# EAGLE design main (EAGLE 8.0.1)
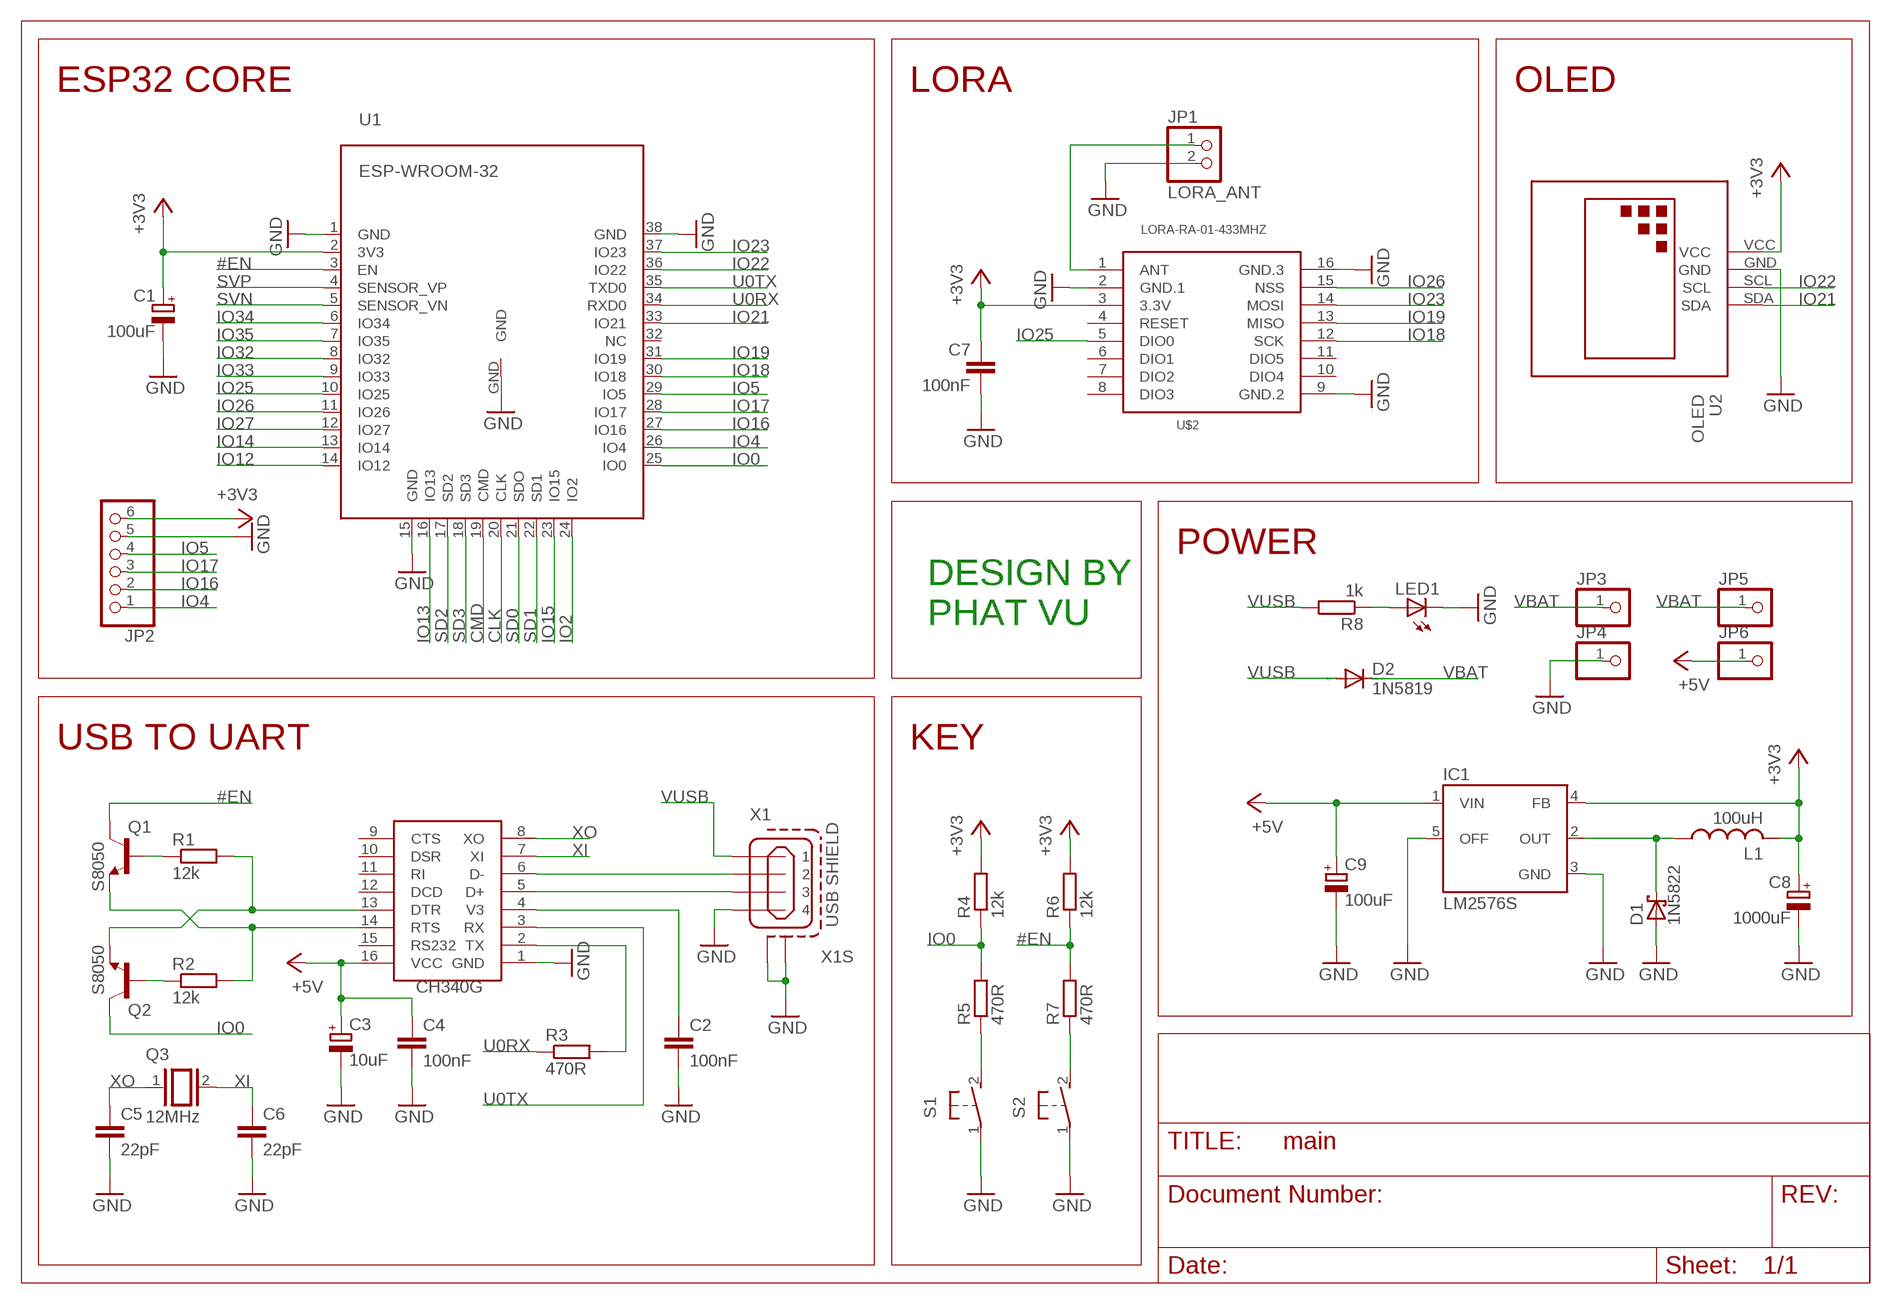
[diagram p0: schematic, sheet 1]

## Parts
C1  100uF  CPOL-EUE5-10.5  [E5-10,5]
C2  100nF  C-EU050-024X044  [C050-024X044]
C3  10uF  CPOL-EUE2.5-6  [E2,5-6]
C4  100nF  C-EU050-024X044  [C050-024X044]
C5  22pF  C-EU050-024X044  [C050-024X044]
C6  22pF  C-EU050-024X044  [C050-024X044]
C7  100nF  C-EU050-024X044  [C050-024X044]
C8  1000uF  CPOL-EUE5-13  [E5-13]
C9  100uF  CPOL-EUE5-10.5  [E5-10,5]
D1  1N5822  SCHOTTKY-DIODEDO201T15  [DO201T15]
D2  1N5819  1N4004  [DO41-10]
IC1  LM2576S  [TO263-5]
JP1  LORA_ANT  PINHD-1X2  [1X02]
JP2  PINHD-1X6  [1X06]
JP3  PINHD-1X1  [1X01]
JP4  PINHD-1X1  [1X01]
JP5  PINHD-1X1  [1X01]
JP6  PINHD-1X1  [1X01]
L1  100uH  L-US6000-XXX-RC  [6000-XXXX-RC]
LED1  LED3MM  [LED3MM]
Q1  S8050  S8050TO92  [TO92-EBC]
Q2  S8050  S8050TO92  [TO92-EBC]
Q3  12MHz  XTAL/S  [QS]
R1  12k  R-EU_0207/10  [0207/10]
R2  12k  R-EU_0207/10  [0207/10]
R3  470R  R-EU_0207/10  [0207/10]
R4  12k  R-EU_0207/10  [0207/10]
R5  470R  R-EU_0207/10  [0207/10]
R6  12k  R-EU_0207/10  [0207/10]
R7  470R  R-EU_0207/10  [0207/10]
R8  1k  R-EU_0207/10  [0207/10]
S1  31-XX  [B3F-31XX]
S2  31-XX  [B3F-31XX]
U1  ESP-WROOM-32  [ESP-WROOM-32]
U2  OLED  OLED-096-I2C  [OLED-096-I2C]
U$1  CH340G  [SOIC16]
U$2  LORA-RA-01-433MHZ  [LORA-RA1-SMD]
X1  USB SHIELD  MINI-USB_SHIELD4P-85-32004-00X  [85-32004-00X]

## Nets
#EN: Q1.C R6.1 R7.2 U1.3(EN)
+3V3: C1.+ C7.1 C8.+ IC1.4(FB) JP2.6 L1.2 R4.2 R6.2 U1.2(3V3) U2.VCC U$2.3(3.3V)
+5V: C3.+ C4.1 C9.+ IC1.1(VIN) JP6.1 U$1.16(VCC)
CLK: U1.20(CLK)
CMD: U1.19(CMD)
GND: C1.- C2.2 C3.- C4.2 C5.2 C6.2 C7.2 C8.- C9.- D1.A IC1.3(GND) IC1.5(OFF) JP1.2 JP2.5 JP4.1 LED1.K(C) S1.1(P) S2.1(P) U1.1(GND) U1.15(GND) U1.38(GND) U1.GND U2.GND U$1.1(GND) U$2.2(GND.1) U$2.9(GND.2) U$2.16(GND.3) X1.4 X1.M1(S1) X1.M2(S2)
IO0: Q2.C R4.1 R5.2 U1.25(IO0)
IO2: U1.24(IO2)
IO4: JP2.1 U1.26(IO4)
IO5: JP2.4 U1.29(IO5)
IO12: U1.14(IO12)
IO13: U1.16(IO13)
IO14: U1.13(IO14)
IO15: U1.23(IO15)
IO16: JP2.2 U1.27(IO16)
IO17: JP2.3 U1.28(IO17)
IO18: U1.30(IO18) U$2.12(SCK)
IO19: U1.31(IO19) U$2.13(MISO)
IO21: U1.33(IO21) U2.SDA
IO22: U1.36(IO22) U2.SCL
IO23: U1.37(IO23) U$2.14(MOSI)
IO25: U1.10(IO25) U$2.5(DIO0)
IO26: U1.11(IO26) U$2.15(NSS)
IO27: U1.12(IO27)
IO32: U1.8(IO32)
IO33: U1.9(IO33)
IO34: U1.6(IO34)
IO35: U1.7(IO35)
N$1: JP1.1 U$2.1(ANT)
N$2: R3.2 U$1.2(TX)
N$3: U$1.6(D-) X1.2
N$4: U$1.5(D+) X1.3
N$5: C2.1 U$1.4(V3)
N$6: Q1.E R2.2 U$1.14(RTS)
N$7: Q2.E R1.2 U$1.13(DTR)
N$8: LED1.A R8.1
N$9: Q2.B R2.1
N$10: Q1.B R1.1
N$11: R7.1 S2.2(S)
N$12: R5.1 S1.2(S)
N$13: D1.C IC1.2(OUT) L1.1
SD0: U1.21(SDO)
SD1: U1.22(SD1)
SD2: U1.17(SD2)
SD3: U1.18(SD3)
SVN: U1.5(SENSOR_VN)
SVP: U1.4(SENSOR_VP)
U0RX: R3.1 U1.34(RXD0)
U0TX: U1.35(TXD0) U$1.3(RX)
VBAT: D2.C JP3.1 JP5.1
VUSB: D2.A R8.2 X1.1
XI: C6.1 Q3.2 U$1.7(XI)
XO: C5.1 Q3.1 U$1.8(XO)
Unconnected: U1.32(NC) U$1.9(CTS) U$1.10(DSR) U$1.11(RI) U$1.12(DCD) U$1.15(RS232) U$2.4(RESET) U$2.6(DIO1) U$2.7(DIO2) U$2.8(DIO3) U$2.10(DIO4) U$2.11(DIO5)

## Notes on the sheet
- ESP32 CORE | LORA | OLED
- POWER
- DESIGN BY
  PHAT VU
- USB TO UART | KEY

## Library data of the parts
C1 C3 C8 C9 = rcl:CPOL-EU: POLARIZED CAPACITOR, European symbol
C2 C4-C7 = rcl:C-EU: CAPACITOR, European symbol
D1 = diode:SCHOTTKY-DIODE: Schottky Diode
D2 = diode:1N4004: DIODE general purpose rectifier, 1 A
IC1 = lm2576:LM2576: National Semiconductor <http://www.national.com> 3.0A "Simple Switcher"(c) 52kHz, Vout 1.23-37V (HV: 57V), Vin 40V (HV: 60V), 50µA standby current
JP1 = pinhead:PINHD-1X2: PIN HEADER
JP2 = pinhead:PINHD-1X6: PIN HEADER
JP3-JP6 = pinhead:PINHD-1X1: PIN HEADER
L1 = rcl:L-US: INDUCTOR, American symbol
LED1 = led:LED: LED OSRAM: - CHIPLED LG R971, LG N971, LY N971, LG Q971, LY Q971, LO R971, LY R971 LH N974, LH R974 LS Q976, LO Q976, LY Q976 LO Q996 - Hyper CHIPLED LW Q18S LB Q993, LB Q99A, LB R99A - SideLED LS A670, LO A670, LY A670, LG A670, LP A670 LB A673, LV A673, LT A673, LW A673 LH A674 LY A675 LS A676, LA A676, LO A676, LY A676, LW A676 LS A679, LY A679, LG A679 - Hyper Micro SIDELED® LS Y876, LA Y876, LO Y876, LY Y876 LT Y87S - SmartLED LW L88C, LW L88S LB L89C, LB L89S, LG L890 LS L89K, LO L89K, LY L89K LS L896, LA L896, LO L896, LY L896 - TOPLED LS T670, LO T670, LY T670, LG T670, LP T670 LSG T670, LSP T670, LSY T670, LOP T670, LYG T670 LG T671, LOG T671, LSG T671 LB T673, LV T673, LT T673, LW T673 LH T674 LS T676, LA T676, LO T676, LY T676, LB T676, LH T676, LSB T676, LW T676 LB T67C, LV T67C, LT T67C, LS T67K, LO T67K, LY T67K, LW E67C LS E67B, LA E67B, LO E67B, LY E67B, LB E67C, LV E67C, LT E67C LW T67C LS T679, LY T679, LG T679 LS T770, LO T770, LY T770, LG T770, LP T770 LB T773, LV T773, LT T773, LW T773 LH T774 LS E675, LA E675, LY E675, LS T675 LS T776, LA T776, LO T776, LY T776, LB T776 LHGB T686 LT T68C, LB T68C - Hyper Mini TOPLED® LB M676 - Mini TOPLED Santana® LG M470 LS M47K, LO M47K, LY M47K Source: http://www.osram.convergy.de LUXEON: - LUMILED® LXK2-PW12-R00, LXK2-PW12-S00, LXK2-PW14-U00, LXK2-PW14-V00 LXK2-PM12-R00, LXK2-PM12-S00, LXK2-PM14-U00 LXK2-PE12-Q00, LXK2-PE12-R00, LXK2-PE12-S00, LXK2-PE14-T00, LXK2-PE14-U00 LXK2-PB12-K00, LXK2-PB12-L00, LXK2-PB12-M00, LXK2-PB14-N00, LXK2-PB14-P00, LXK2-PB14-Q00 LXK2-PR12-L00, LXK2-PR12-M00, LXK2-PR14-Q00, LXK2-PR14-R00 LXK2-PD12-Q00, LXK2-PD12-R00, LXK2-PD12-S00 LXK2-PH12-R00, LXK2-PH12-S00 LXK2-PL12-P00, LXK2-PL12-Q00, LXK2-PL12-R00 Source: www.luxeon.com KINGBRIGHT: KA-3528ASYC Source: www.kingbright.com
Q1 Q2 = s8050:S8050
Q3 = special:XTAL/S: CRYSTAL
R1-R8 = rcl:R-EU_: RESISTOR, European symbol
S1 S2 = switch-omron:31-XX: OMRON SWITCH; MPN: B3F-3100; OC_FARNELL: 959704; OC_NEWARK: 36M3582
U1 = esp32:ESP-WROOM-32
U2 = oled:OLED-096-I2C
U$1 = ch340g:CH340G
U$2 = lora:LORA-RA-01-433MHZ: 433 MHz Lora Ra-01 Radio Transceiver Module based on SX1278 chip.
X1 = con-cypressindustries:MINI-USB_SHIELD4P-: MINI USB 4 Pol. Source: www.cypressindustries.com; OC_FARNELL: unknown; OC_NEWARK: unknown

## Board
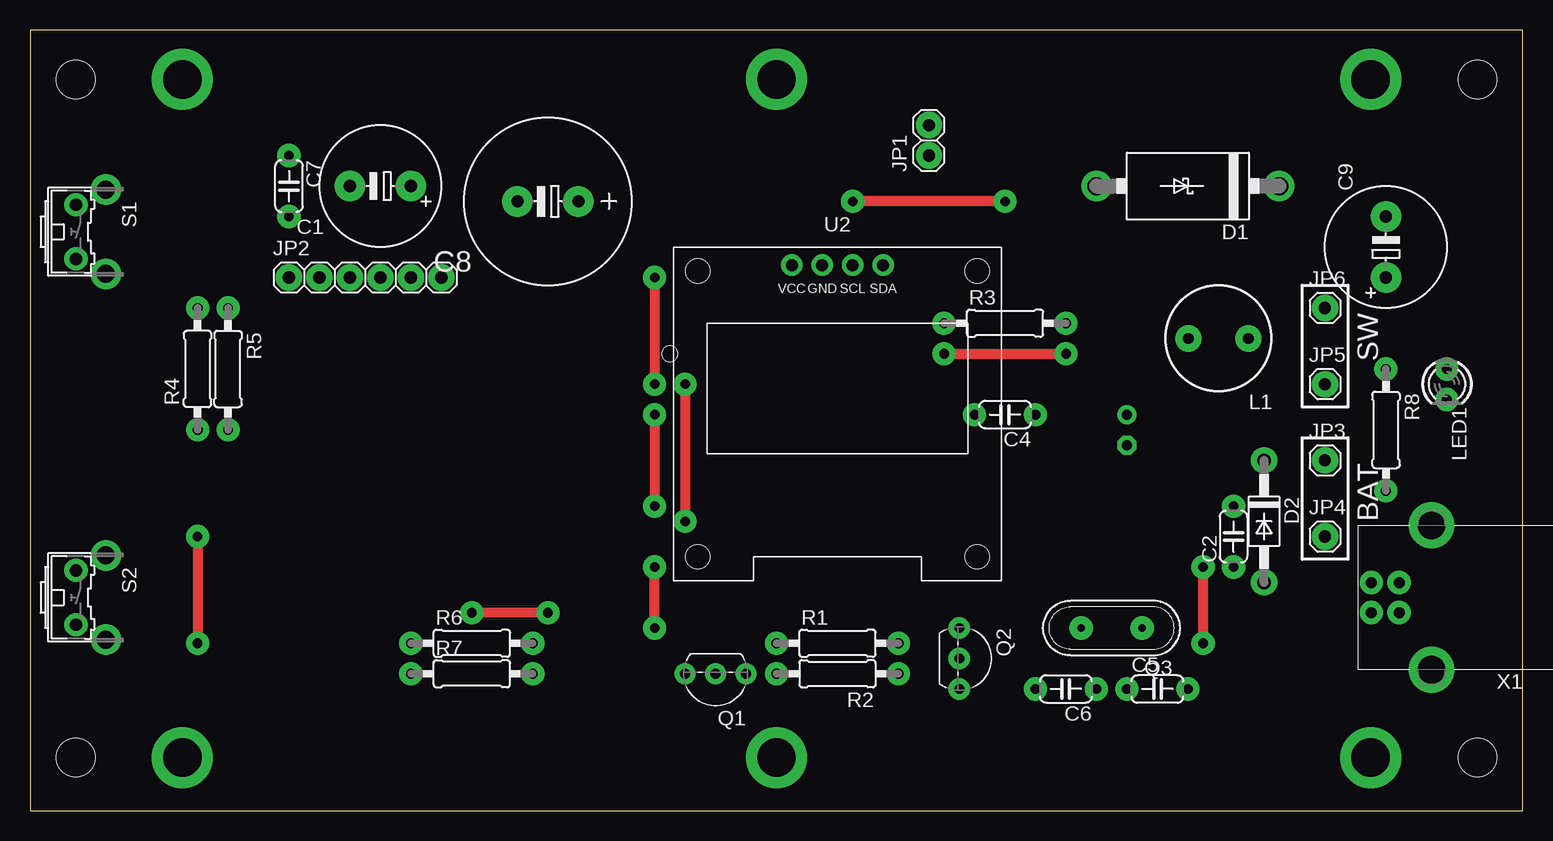
[diagram p1: board, top side]
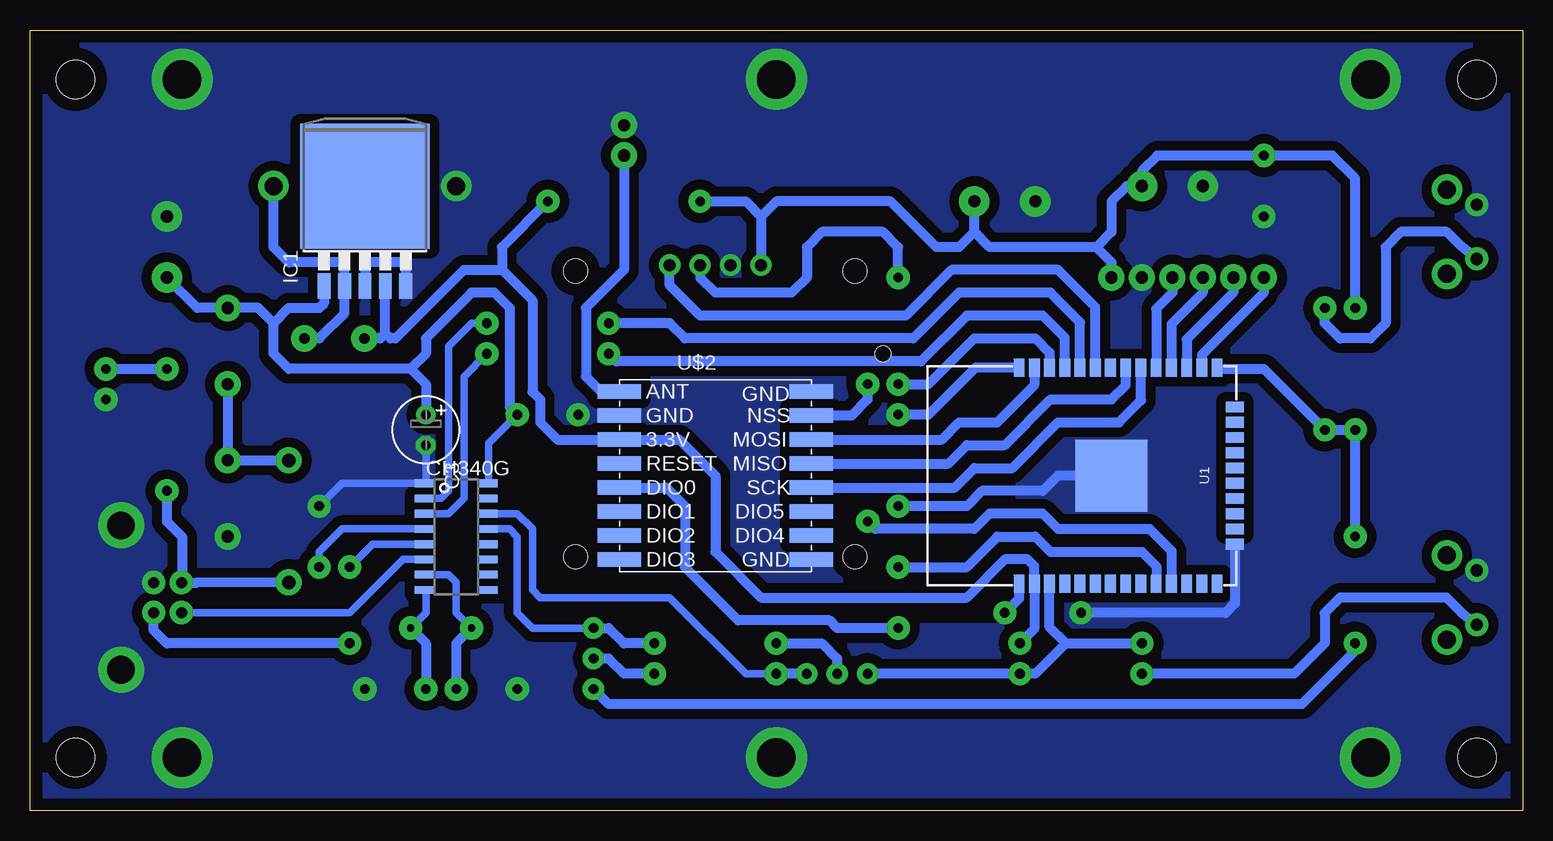
[diagram p2: board, bottom side, seen from below]

Size 124.44 x 65.08 mm. Coordinates in mm from the lower left corner, seen from the top.
Outline: 0,0 124.44,0 124.44,65.08 0,65.08 0,0
Copper layers (1*16): Top 0.035mm / dielectric 1.5mm / Bottom 0.035mm
Design rules "default": minimum track width 10mil, minimum drill 24mil, track to track 8mil, track to pad 8mil, pad to pad 8mil, via to via 8mil, smd to smd 8mil, copper to edge 40mil, drill to drill 8mil, minimum pad ring 10mil, minimum via ring 8mil, stop-mask expansion 4mil, vias tented up to drill 0mil, thermal gap 10mil
Holes 1.3 mm at 53.34,38.1
Holes 3.2 mm at 120.65,60.96 120.65,4.45 3.81,4.45 3.81,60.96

### Footprints (pad centres in the part's own frame; a part is rotated, then mirrored left to right if it is on the bottom)
E5-10,5 = drill 1.016 pad 2.54: + -2.54,0; - 2.54,0
C050-024X044 = drill 0.813 pad 1.93: 1 -2.54,0; 2 2.54,0
E2,5-6 = drill 0.813 pad 1.6: + -1.27,0 | drill 0.813 pad 1.6 octagon: - 1.27,0
E5-13 = drill 1.016 pad 2.54: + -2.54,0; - 2.54,0
DO201T15 = drill 1.499 pad 2.54: A 7.62,0; C -7.62,0
DO41-10 = drill 1.118 pad 2.184: A 5.08,0; C -5.08,0
TO263-5 = smd 1.067 x 2.159: 1 -3.404,-5.791; 2 -1.702,-5.791; 3 0,-5.791; 4 1.702,-5.791; 5 3.404,-5.791 | smd 10.8 x 10.41: 6 0,2.54
1X02 = drill 1.016 pad 2.184: 1 -1.27,0; 2 1.27,0
1X06 = drill 1.016 pad 2.184: 1 -6.35,0; 2 -3.81,0; 3 -1.27,0; 4 1.27,0; 5 3.81,0; 6 6.35,0
1X01 = drill 1.016 pad 2.184: 1 0,0
6000-XXXX-RC = drill 0.9 pad 2.184: 1 -2.5,0; 2 2.5,0
LED3MM = drill 0.813 pad 1.93: A -1.27,0; K 1.27,0
TO92-EBC = drill 0.813 pad 1.778: B 0,-1.27; C 2.54,-1.27; E -2.54,-1.27
QS = drill 0.61 pad 1.93: 1 -2.54,0; 2 2.54,0
0207/10 = drill 0.813 pad 1.93: 1 -5.08,0; 2 5.08,0
B3F-31XX = drill 1.016 pad 1.93: 1 -2.261,-1.245; 2 2.261,-1.245 | drill 1.499 pad 2.54: 3 -3.505,1.245; 4 3.505,1.245
ESP-WROOM-32 = smd 0.9 x 1.5: 1 7.7,9; 2 6.43,9; 3 5.16,9; 4 3.89,9; 5 2.62,9; 6 1.35,9; 7 0.08,9; 8 -1.19,9; 9 -2.46,9; 10 -3.73,9; 11 -5,9; 12 -6.27,9; 13 -7.54,9; 14 -8.81,9; 25 -8.81,-9; 26 -7.54,-9; 27 -6.27,-9; 28 -5,-9; 29 -3.73,-9; 30 -2.46,-9; 31 -1.19,-9; 32 0.08,-9; 33 1.35,-9; 34 2.62,-9; 35 3.89,-9; 36 5.16,-9; 37 6.43,-9; 38 7.7,-9 | smd 1.5 x 0.9: 15 -10.3,5.715; 16 -10.3,4.445; 17 -10.3,3.175; 18 -10.3,1.905; 19 -10.3,0.635; 20 -10.3,-0.635; 21 -10.3,-1.905; 22 -10.3,-3.175; 23 -10.3,-4.445; 24 -10.3,-5.715 | smd 6 x 6: GND 0,0
OLED-096-I2C = drill 1 pad 1.778: GND -1.27,9.93; SCL 1.27,9.93; SDA 3.81,9.93; VCC -3.81,9.93 | hole 2: -11.65,9.43; 11.65,9.43; -11.65,-14.37; 11.65,-14.37
SOIC16 = smd 0.635 x 1.524: 1 -4.445,-2.695; 2 -3.175,-2.695; 3 -1.905,-2.695; 4 -0.635,-2.695; 5 0.635,-2.695; 6 1.905,-2.695; 7 3.175,-2.695; 8 4.445,-2.695; 9 4.445,2.695; 10 3.175,2.695; 11 1.905,2.695; 12 0.635,2.695; 13 -0.635,2.695; 14 -1.905,2.695; 15 -3.175,2.695; 16 -4.445,2.695
LORA-RA1-SMD = smd 3.6 x 1.2: 1 -8,7; 2 -8,5; 3 -8,3; 4 -8,1; 5 -8,-1; 6 -8,-3; 7 -8,-5; 8 -8,-7; 9 8,-7; 10 8,-5; 11 8,-3; 12 8,-1; 13 8,1; 14 8,3; 15 8,5; 16 8,7
85-32004-00X = drill 0.92 pad 1.93: 1 5.027,-1.25; 2 5.027,1.25; 3 2.71,1.25; 4 2.71,-1.25 | drill 2.3 pad 3.81: M1 0,6.02; M2 0,-6.02

### Placement (x,y rotation side)
C1  29.21,52.07 180 top
C2  100.33,22.86 90 top
C3  91.44,31.75 270 bottom
C4  81.28,33.02 180 top
C5  93.98,10.16 0 top
C6  86.36,10.16 180 top
C7  21.59,52.07 270 top
C8  43.18,50.8 180 top
C9  113.03,46.99 90 top
D1  96.52,52.07 180 top
D2  102.87,24.13 270 top
IC1  96.52,49.53 0 bottom
JP1  74.93,55.88 90 top
JP2  27.94,44.45 0 top
JP3  107.95,29.21 0 top
JP4  107.95,22.86 0 top
JP5  107.95,35.56 0 top
JP6  107.95,41.91 0 top
L1  99.06,39.37 180 top
LED1  118.11,35.56 270 top
Q1  57.15,10.16 180 top
Q2  78.74,12.7 270 top
Q3  90.17,15.24 180 top
R1  67.31,13.97 0 top
R2  67.31,11.43 180 top
R3  81.28,40.64 0 top
R4  13.97,36.83 90 top
R5  16.51,36.83 270 top
R6  36.83,13.97 0 top
R7  36.83,11.43 0 top
R8  113.03,31.75 270 top
S1  5.08,48.26 270 top
S2  5.08,17.78 270 top
U1  34.29,27.94 180 bottom
U2  67.31,35.56 0 top
U$1  88.9,22.86 270 bottom
U$2  67.31,27.94 0 bottom
X1  116.84,17.78 180 top

### Tracks (layer width: path | path; a pad name or v marks a point on that pad's centre or on a via)
#EN
  Bottom 0.813: 38.1,13.97 40.64,11.43 R7.2 Q1.C | 38.1,13.97 R6.1 | 38.1,13.97 39.45,15.32 U1.3
+3V3  (via drill 0.8 pad 1.93)
  Top 0.813: v81.28,50.8 v68.58,50.8
  Bottom 0.813: R6.2 40.72,15.16 U1.2 40.72,20.4 41.27,20.95 43.18,20.95 46.35,17.78 63.5,17.78 67.31,21.59 67.31,27.94 70.31,30.94 U$2.3 80.47,30.94 81.92,32.38 81.92,34.29 82.55,34.92 82.55,42.55 85.09,45.09 | 85.09,45.09 88.27,45.09 93.98,39.37 94.39,39.37 94.82,39.8 | 94.82,39.8 IC1.4 | 94.82,39.8 95.25,39.37 L1.2 96.56,39.33 | 45.72,48.26 44.45,46.99 35.56,46.99 | 45.72,48.26 C8.+ | 45.72,48.26 46.99,46.99 48.9,46.99 52.7,50.8 62.23,50.8 63.5,49.53 | 63.5,49.53 U2.VCC | v68.58,50.8 64.77,50.8 63.5,49.53 | v81.28,50.8 85.09,46.99 85.09,45.09 | JP2.6 34.29,45.72 35.56,46.99 | 35.56,46.99 34.29,48.26 34.29,50.8 33.02,52.07 C1.+ 31.75,53.34 30.48,54.61 C7.1 15.88,54.61 13.97,52.7 R4.2
+5V
  Bottom 0.61: C4.1 86.2,30.64 U$1.16
  Bottom 0.813: C3.+ 91.44,35.56 92.71,36.83 | C4.1 84.45,33.66 84.45,41.91 85.72,43.18 87.63,43.18 91.44,39.37 91.44,38.1 92.71,36.83 | IC1.1 99.92,42.32 100.33,41.91 102.87,41.91 104.14,40.64 | C9.+ 110.49,41.91 JP6.1 105.41,41.91 104.14,40.64 | 92.71,36.83 102.87,36.83 104.14,38.1 104.14,40.64
GND  (via drill 0.8 pad 1.93, 3.2 pad 5.08)
  Top 0.813: v43.18,16.51 v36.83,16.51 | v52.07,33.02 v52.07,25.4
  Bottom 0.61: C3.- 91.44,27.46 U$1.1 98.42,27.3 C2.2
  Bottom 0.813: IC1.5 93.12,45.72 96.52,45.72 IC1.3 | U1.1 41.99,17.7 v43.18,16.51 | U1.15 23.99,17.29 24.77,16.51 v36.83,16.51 | 33.02,27.94 31.75,27.94 | U1.38 45.61,36.94 49.53,33.02 v52.07,33.02 | 34.29,26.67 33.02,27.94 | v52.07,25.4 46.35,25.4 45.09,26.67 40.01,26.67 38.73,27.94 U1.GND 33.02,27.94
  other vias: 111.76,60.96 111.76,4.45 12.7,4.45 12.7,60.96 62.23,4.45 62.23,60.96
  pour Bottom (isolate 0.813, no thermals): 0,65.41 124.46,65.41 124.46,0 0,0
IO0  (via drill 0.8 pad 1.93)
  Top 0.813: v13.97,22.86 v13.97,13.97
  Bottom 0.813: Q2.C 76.2,8.89 18.41,8.89 13.97,13.34 v13.97,13.97 | v13.97,22.86 R4.1 R5.2 21.59,36.83 25.37,36.83 U1.25
IO4
  Bottom 0.813: JP2.1 21.59,43.18 26.75,38.02 U1.26
IO5
  Bottom 0.813: U1.29 30.56,41.83 29.21,43.18 JP2.4
IO16
  Bottom 0.813: JP2.2 24.13,43.18 28.02,39.29 U1.27
IO17
  Bottom 0.813: JP2.3 26.67,43.18 29.29,40.56 U1.28
IO18
  Bottom 0.813: U1.30 31.83,34.21 33.66,32.38 38.73,32.38 42.55,28.57 45.72,28.57 47.35,26.94 U$2.12
IO19
  Bottom 0.813: U1.31 33.1,35.48 34.29,34.29 39.37,34.29 43.18,30.48 46.35,30.48 47.9,28.94 U$2.13
IO21
  Bottom 0.813: U1.33 35.64,41.99 38.73,45.09 47.62,45.09 51.44,41.27 68.58,41.27 71.12,43.81 U2.SDA
IO22  (via drill 0.8 pad 1.93)
  Top 0.813: v52.07,44.45 v52.07,35.56
  Bottom 0.813: U2.SCL 68.58,44.45 67.31,43.18 60.96,43.18 59.69,44.45 59.69,46.99 58.42,48.26 53.34,48.26 52.07,46.99 v52.07,44.45 | v52.07,35.56 49.53,35.56 45.72,39.37 40.64,39.37 39.45,38.18 U1.36
IO23
  Bottom 0.813: U1.37 40.72,35.48 43.81,32.38 46.99,32.38 48.44,30.94 U$2.14
IO25  (via drill 0.8 pad 1.93)
  Top 0.813: v52.07,15.24 v52.07,20.32
  Bottom 0.813: U$2.5 71.39,26.94 69.85,25.4 69.85,20.32 65.41,15.88 57.78,15.88 57.15,15.24 v52.07,15.24 | v52.07,20.32 46.35,20.32 43.81,22.86 40.64,22.86 39.37,21.59 31.75,21.59 30.56,20.4 U1.10
IO26  (via drill 0.8 pad 1.93)
  Top 0.813: v54.61,35.56 v54.61,24.13
  Bottom 0.813: U1.11 29.29,21.67 31.11,23.5 38.73,23.5 40.01,24.77 44.45,24.77 45.72,23.5 53.98,23.5 v54.61,24.13 | v54.61,35.56 54.61,34.29 55.96,32.94 U$2.15
N$1
  Bottom 0.813: JP1.1 74.93,45.09 78.11,41.91 78.11,36.2 76.85,34.94 U$2.1
N$2
  Bottom 0.61: U$1.2 90.17,26.04 89.53,26.67 89.53,38.73 87.63,40.64 R3.2
N$3
  Bottom 0.61: U$1.6 93.34,20.95 97.79,16.51 112.11,16.51 X1.2
N$4  (via drill 0.8 pad 1.93)
  Top 0.813: v97.79,20.32 v97.79,13.97
  Bottom 0.61: U$1.5 95.89,22.23 v97.79,20.32
  Bottom 0.813: v97.79,13.97 113.03,13.97 114.13,15.07 X1.3
N$5
  Bottom 0.61: U$1.4 98.42,23.5 100.33,21.59 C2.1
N$6
  Bottom 0.61: R2.2 64.77,11.43 71.12,17.78 81.92,17.78 82.55,18.41 82.55,23.5 83.82,24.77 U$1.14
  Bottom 0.813: Q1.E R2.2
N$7
  Bottom 0.61: U$1.13 84.45,23.5 83.82,22.86 83.82,16.51 82.55,15.24 Q2.E
  Bottom 0.813: R1.2 74.93,13.97 76.2,15.24 Q2.E
N$8
  Bottom 0.813: LED1.A R8.1
N$9
  Bottom 0.813: R2.1 74.93,11.43 76.2,12.7 Q2.B
N$10
  Bottom 0.813: R1.1 58.42,13.97 57.15,12.7 Q1.B
N$11
  Bottom 0.813: R7.1 19.05,11.43 16.51,13.97 16.51,16.51 15.24,17.78 6.35,17.78 5.08,16.51 5.11,16.48 S2.2
N$12
  Bottom 0.813: S1.2 5.11,47.02 6.35,48.26 10.16,48.26 11.43,46.99 11.43,40.64 12.7,39.37 15.24,39.37 16.51,40.64 R5.1
N$13
  Bottom 0.813: L1.1 100.33,39.37 98.22,41.48 IC1.2 98.22,45.52 98.42,45.72 102.87,45.72 104.14,46.99 D1.C
U0RX
  Bottom 0.813: U1.34 36.91,40.72 39.37,43.18 46.99,43.18 50.8,39.37 69.85,39.37 71.12,40.64 R3.1
U0TX  (via drill 0.8 pad 1.93)
  Top 0.813: v76.2,38.1 v86.36,38.1
  Bottom 0.61: U$1.3 89.53,24.77 88.27,26.04 88.27,36.2 v86.36,38.1
  Bottom 0.813: U1.35 38.18,39.45 40.01,41.27 46.35,41.27 50.16,37.47 75.56,37.47 v76.2,38.1
VBAT
  Bottom 0.813: D2.C JP3.1 JP5.1
VUSB
  Bottom 0.813: D2.A 110.51,19.03 X1.1 111.76,19.08 111.76,22.86 113.03,24.13 R8.2
XI
  Bottom 0.61: U$1.7 89.53,19.68 88.9,19.05 88.9,16.51 Q3.2
  Bottom 0.813: Q3.2 88.9,13.97 C6.1
XO
  Bottom 0.61: U$1.8 91.44,18.26 91.44,16.51 Q3.1
  Bottom 0.813: Q3.1 91.44,13.97 C5.1

### Text on the board
tPlace: SW | BAT